# Altium schematic sheet Juricic_Ulaz.SchDoc
size A
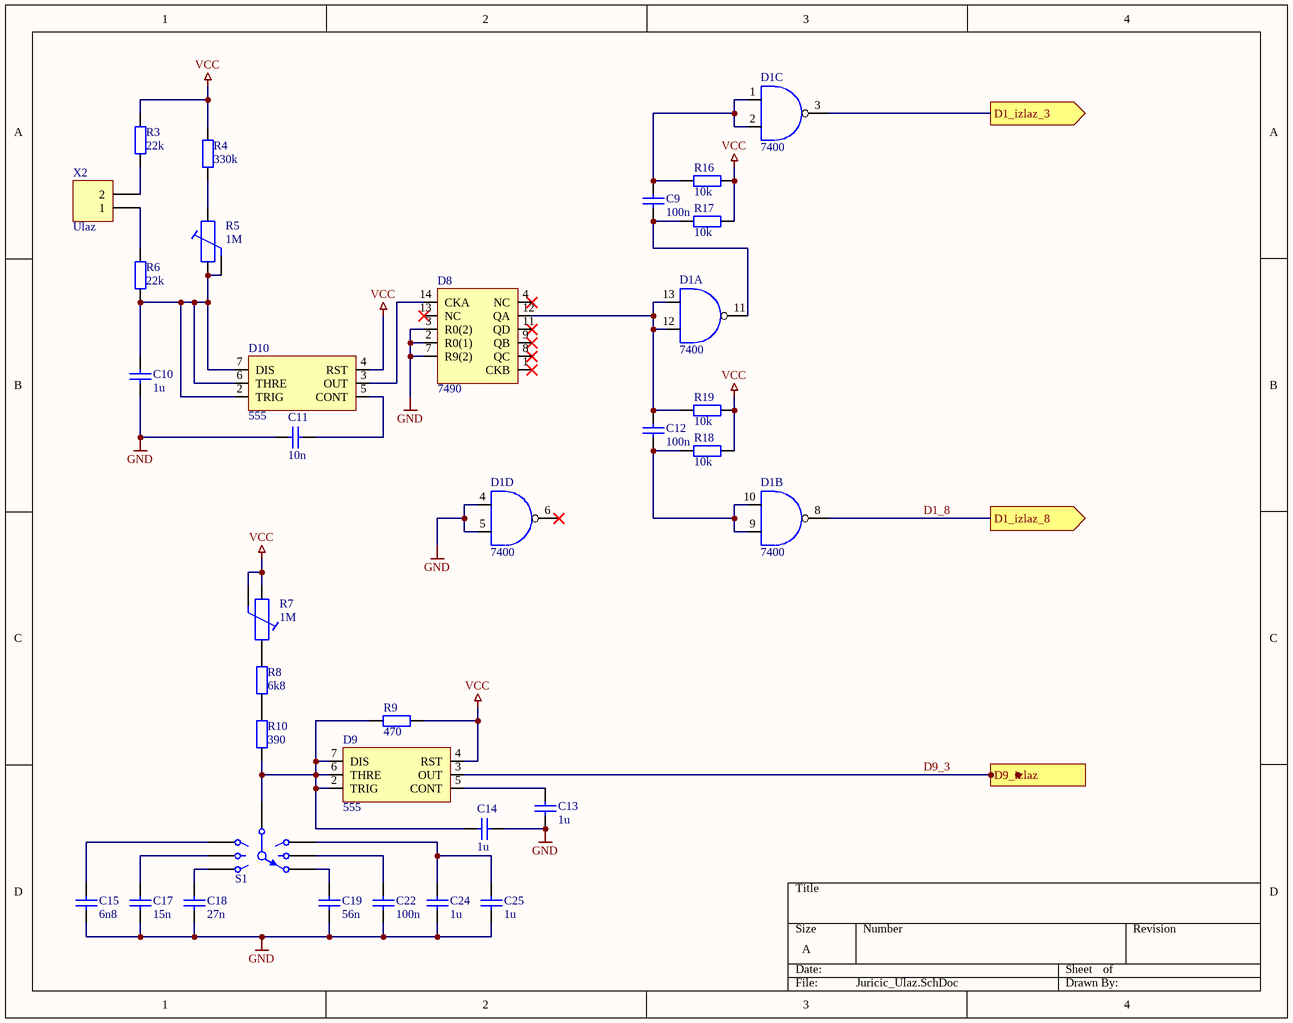
[diagram p0: Juricic_Ulaz.SchDoc]

## Parts
C9  100n  [C0805]
C10  1u  [C0805]
C11  10n  [C0805]
C12  100n  [C0805]
C13  1u  [C0805]
C14  1u  [C0805]
C15  6n8  [C0805]
C17  15n  [C0805]
C18  27n  [C0805]
C19  56n  [C0805]
C22  100n  [C0805]
C24  1u  [C0805]
C25  1u  [C0805]
D1  7400  [DIP-14]  (parts A,B,C,D of 4)
D8  7490  [DIP-14]
D9  555  [DIP-8]
D10  555  [DIP-8]
R3  22k  [AXIAL-0.4]
R4  330k  [AXIAL-0.4]
R5  1M  [Trimmer]
R6  22k  [AXIAL-0.4]
R7  1M  [Trimmer]
R8  6k8  [AXIAL-0.4]
R9  470  [AXIAL-0.4]
R10  390  [AXIAL-0.4]
R16  10k  [AXIAL-0.4]
R17  10k  [AXIAL-0.4]
R18  10k  [AXIAL-0.4]
R19  10k  [AXIAL-0.4]
S1  SW-6WAY  [SW-7]  (value not drawn)
X2  Ulaz  [HDR1X2]

## Ports
D1_izlaz_3 (out), D1_izlaz_8 (out), D9_izlaz (out)

## Nets
GND: C10.1 C11.2 C13.2 C14.1 C15.1 C17.1 C18.1 C19.1 C22.1 C24.1 C25.1 D1.4 D1.5 D8.2(R0(1)) D8.3(R0(2)) D8.7(R9(2))
VCC: D9.4(RST) D10.4(RST) R3.2 R4.2 R7.2 R7.3 R9.2 R16.2 R17.2 R18.2 R19.2
D1_8: D1.8 ; port D1_izlaz_8
D1_izlaz_3: D1.3 ; port D1_izlaz_3
D9_3: D9.3(OUT) ; port D9_izlaz
NetC9_1: C9.1 D1.11 R17.1
NetC9_2: C9.2 D1.1 D1.2 R16.1
NetC10_2: C10.2 D10.2(TRIG) D10.6(THRE) D10.7(DIS) R5.2 R5.3 R6.2
NetC11_1: C11.1 D10.5(CONT)
NetC12_1: C12.1 D1.9 D1.10 R18.1
NetC12_2: C12.2 D1.12 D1.13 D8.12(QA) R19.1
NetC13_1: C13.1 D9.5(CONT)
NetC14_2: C14.2 D9.2(TRIG) D9.6(THRE) D9.7(DIS) R9.1 R10.2 S1.7
NetC15_2: C15.2 S1.1
NetC17_2: C17.2 S1.2
NetC18_2: C18.2 S1.3
NetC19_2: C19.2 S1.6
NetC22_2: C22.2 S1.5
NetC24_2: C24.2 C25.2 S1.4
NetD8_14: D8.14(CKA) D10.3(OUT)
NetR3_1: R3.1 X2.2
NetR4_1: R4.1 R5.1
NetR6_1: R6.1 X2.1
NetR7_1: R7.1 R8.1
NetR8_2: R8.2 R10.1

Not connected (* = marked no-connect by the designer): D1 6(18)*; D8 1(CKB)* 4(NC)* 8(QC)* 9(QB)* 11(QD)* 13(NC)*

## Library data of the parts
C9 C12 C22 = Cap: 100n capacitor; Published: 8-Jun-2000; LatestRevisionDate: 17-Jul-2002; LatestRevisionNote: Re-released for DXP Platform.; PackageReference: RAD-0.3; Publisher: Altium Limited; PackageDescription: Radial Cap, Thru-Hole; 2 Leads; 0.3 in Pin Spacing
C10 C24 C25 = Cap: 1u capacitor; Published: 8-Jun-2000; LatestRevisionDate: 17-Jul-2002; LatestRevisionNote: Re-released for DXP Platform.; PackageReference: RAD-0.3; Publisher: Altium Limited; PackageDescription: Radial Cap, Thru-Hole; 2 Leads; 0.3 in Pin Spacing
C11 = Cap: 10n capacitor; Published: 8-Jun-2000; LatestRevisionDate: 17-Jul-2002; LatestRevisionNote: Re-released for DXP Platform.; PackageReference: RAD-0.3; Publisher: Altium Limited; PackageDescription: Radial Cap, Thru-Hole; 2 Leads; 0.3 in Pin Spacing
C13 C14 = Cap: 1u capacitor; Value: 100pF; Published: 8-Jun-2000; LatestRevisionDate: 17-Jul-2002; LatestRevisionNote: Re-released for DXP Platform.; PackageReference: RAD-0.3; Publisher: Altium Limited; PackageDescription: Radial Cap, Thru-Hole; 2 Leads; 0.3 in Pin Spacing
C15 = Cap: 6n8 capacitor; Published: 8-Jun-2000; LatestRevisionDate: 17-Jul-2002; LatestRevisionNote: Re-released for DXP Platform.; PackageReference: RAD-0.3; Publisher: Altium Limited; PackageDescription: Radial Cap, Thru-Hole; 2 Leads; 0.3 in Pin Spacing
C17 = Cap: 15n capacitor; Published: 8-Jun-2000; LatestRevisionDate: 17-Jul-2002; LatestRevisionNote: Re-released for DXP Platform.; PackageReference: RAD-0.3; Publisher: Altium Limited; PackageDescription: Radial Cap, Thru-Hole; 2 Leads; 0.3 in Pin Spacing
C18 = Cap: 27n capacitor; Published: 8-Jun-2000; LatestRevisionDate: 17-Jul-2002; LatestRevisionNote: Re-released for DXP Platform.; PackageReference: RAD-0.3; Publisher: Altium Limited; PackageDescription: Radial Cap, Thru-Hole; 2 Leads; 0.3 in Pin Spacing
C19 = Cap: 56n capacitor; Published: 8-Jun-2000; LatestRevisionDate: 17-Jul-2002; LatestRevisionNote: Re-released for DXP Platform.; PackageReference: RAD-0.3; Publisher: Altium Limited; PackageDescription: Radial Cap, Thru-Hole; 2 Leads; 0.3 in Pin Spacing
D1 = 7400: NI sklop; Cijena: 1.41; Kat. broj: 3119930; Dobavljač: Farnell
D8 = 7490: Dekadsko/binarno brojilo; Cijena: 1.33; Kat. broj: 1470790; Dobavljač: Farnell
D9 D10 = 555: Cijena: 0.689; Kat. broj: 3121211; Dobavljač: Farnell
  D10: Parameter 2: *; Parameter 3: *
R3 R6 = Res2: 22k resistor; Published: 8-Jun-2000; LatestRevisionDate: 17-Jul-2002; LatestRevisionNote: Re-released for DXP Platform.; PackageReference: AXIAL-0.4; Publisher: Altium Limited; PackageDescription: Axial Device, Thru-Hole; 2 Leads; 0.4 in Pin Spacing
R4 = Res2: 330k resistor; Published: 8-Jun-2000; LatestRevisionDate: 17-Jul-2002; LatestRevisionNote: Re-released for DXP Platform.; PackageReference: AXIAL-0.4; Publisher: Altium Limited; PackageDescription: Axial Device, Thru-Hole; 2 Leads; 0.4 in Pin Spacing
R5 R7 = Trimmer
R8 = Res2: 6k8 resistor; Published: 8-Jun-2000; LatestRevisionDate: 17-Jul-2002; LatestRevisionNote: Re-released for DXP Platform.; PackageReference: AXIAL-0.4; Publisher: Altium Limited; PackageDescription: Axial Device, Thru-Hole; 2 Leads; 0.4 in Pin Spacing
R9 = Res2: 470 resistor; Value: 1K; Published: 8-Jun-2000; LatestRevisionDate: 17-Jul-2002; LatestRevisionNote: Re-released for DXP Platform.; PackageReference: AXIAL-0.4; Publisher: Altium Limited; PackageDescription: Axial Device, Thru-Hole; 2 Leads; 0.4 in Pin Spacing
R10 = Res2: 390 resistor; Published: 8-Jun-2000; LatestRevisionDate: 17-Jul-2002; LatestRevisionNote: Re-released for DXP Platform.; PackageReference: AXIAL-0.4; Publisher: Altium Limited; PackageDescription: Axial Device, Thru-Hole; 2 Leads; 0.4 in Pin Spacing
R16-R18 = Res2: 10k resistor; Published: 8-Jun-2000; LatestRevisionDate: 17-Jul-2002; LatestRevisionNote: Re-released for DXP Platform.; PackageReference: AXIAL-0.4; Publisher: Altium Limited; PackageDescription: Axial Device, Thru-Hole; 2 Leads; 0.4 in Pin Spacing
R19 = Res2: 10k resistor; Value: 1K; Published: 8-Jun-2000; LatestRevisionDate: 17-Jul-2002; LatestRevisionNote: Re-released for DXP Platform.; PackageReference: AXIAL-0.4; Publisher: Altium Limited; PackageDescription: Axial Device, Thru-Hole; 2 Leads; 0.4 in Pin Spacing
S1 = SW-6WAY: 6 Way Switch; Published: 24-Mar-1999; LatestRevisionDate: 17-Jul-2002; LatestRevisionNote: Re-released for DXP Platform.; PackageReference: SW-7; Publisher: Altium Limited; PackageDescription: Switch; 7 Leads
X2 = Header 2: Header, 2-Pin; Kat. broj: 3417645; Cijena: 0.319; LatestRevisionDate: 17-Jul-2002; LatestRevisionNote: Re-released for DXP Platform.; Publisher: Altium Limited